# Altium schematic sheet Featherweight_Connector_1.SchDoc
size Letter; SheetNumber: 1; SheetTotal: 1
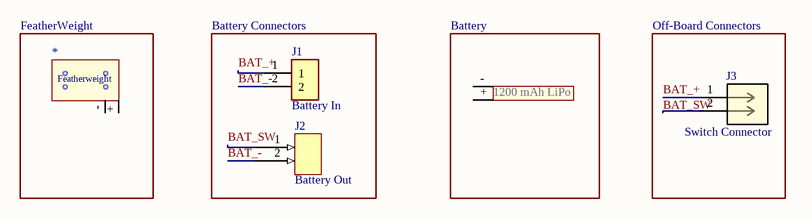
[diagram p0: Featherweight_Connector_1.SchDoc]

## Parts
*  Featherweight  [Featherweight-Footprint-1]  (value not drawn)
?  1200mAh LiPo x1 Holder  [LiPo Holder-Footprint-1]  (value not drawn)
J1  Battery In  [JST_B2B-PH-K-S(LF)(SN)]
J2  Battery Out  [1984769-Footprint-1]
J3  Switch Connector

## Blocks framed on the sheet
FeatherWeight: *
Battery Connectors: J1 J2
Battery: ?
Off-Board Connectors: J3

## Nets
BAT_+: J1.1 J3.1
BAT_-: J1.2 J2.2
BAT_SW: J2.1 J3.2

Not connected (* = marked no-connect by the designer): * + -; ? +(_) -(_)

## Notes on the sheet
- (in symbol CMP-00028-00013-6) 1200 mAh LiPo

## Library data of the parts
* = CMP-00028-00009-5: Featherweight GPS tracker footprint
? = CMP-00028-00013-6: Holder for LiPo Pouch Type Battery
J1 = CMP-002-000011-1: PH Series 2 Position 2 mm Pitch Through Hole Top Entry Shrouded Header; MF: {'manufacturer': u'JST Sales'}; Design Item ID: B2B-PH-K-S(LF)(SN); Component Type: Standard; Source: B2B-PH-K-S(LF)(SN).SchLib; Price: None; Availability: Unavailable; Value: *; MP: B2B-PH-K-S(LF)(SN); Pin Count: 2; Package: None
J2 = CMP-00028-00010-3: Terminal Block, Printed Circuit; 10 A; 160 V; 3.5 mm; 2; 3.5 mm; 1.2 mm; M2; PA
J3 = CMP-005-000001-1: No Description Available; Mfr_Name: Molex Connector Corporation; Copyright: Copyright (C) 2022 Ultra Librarian. All rights reserved.; Source: DEP_REVC.SCHLIB; Manufacturer_Part_Number: 1726480102; Component Type: Standard; Pin Count: 2; Type: DEV; Design Item ID: 1726480102; RefDes: RefDes